# Altium schematic sheet FPGA Sheet1.SchDoc
size A2; Generated From FPGA Project: PortSwitcherFPGA1C.PrjFpg; UNUSED_SPECIAL: RouteSeparate; UNUSED_IO: NoERC; VREF: NoERC; UNUSED_INPUT: NoERC; DocumentNumber: 5; SheetNumber: 5; SheetTotal: 7
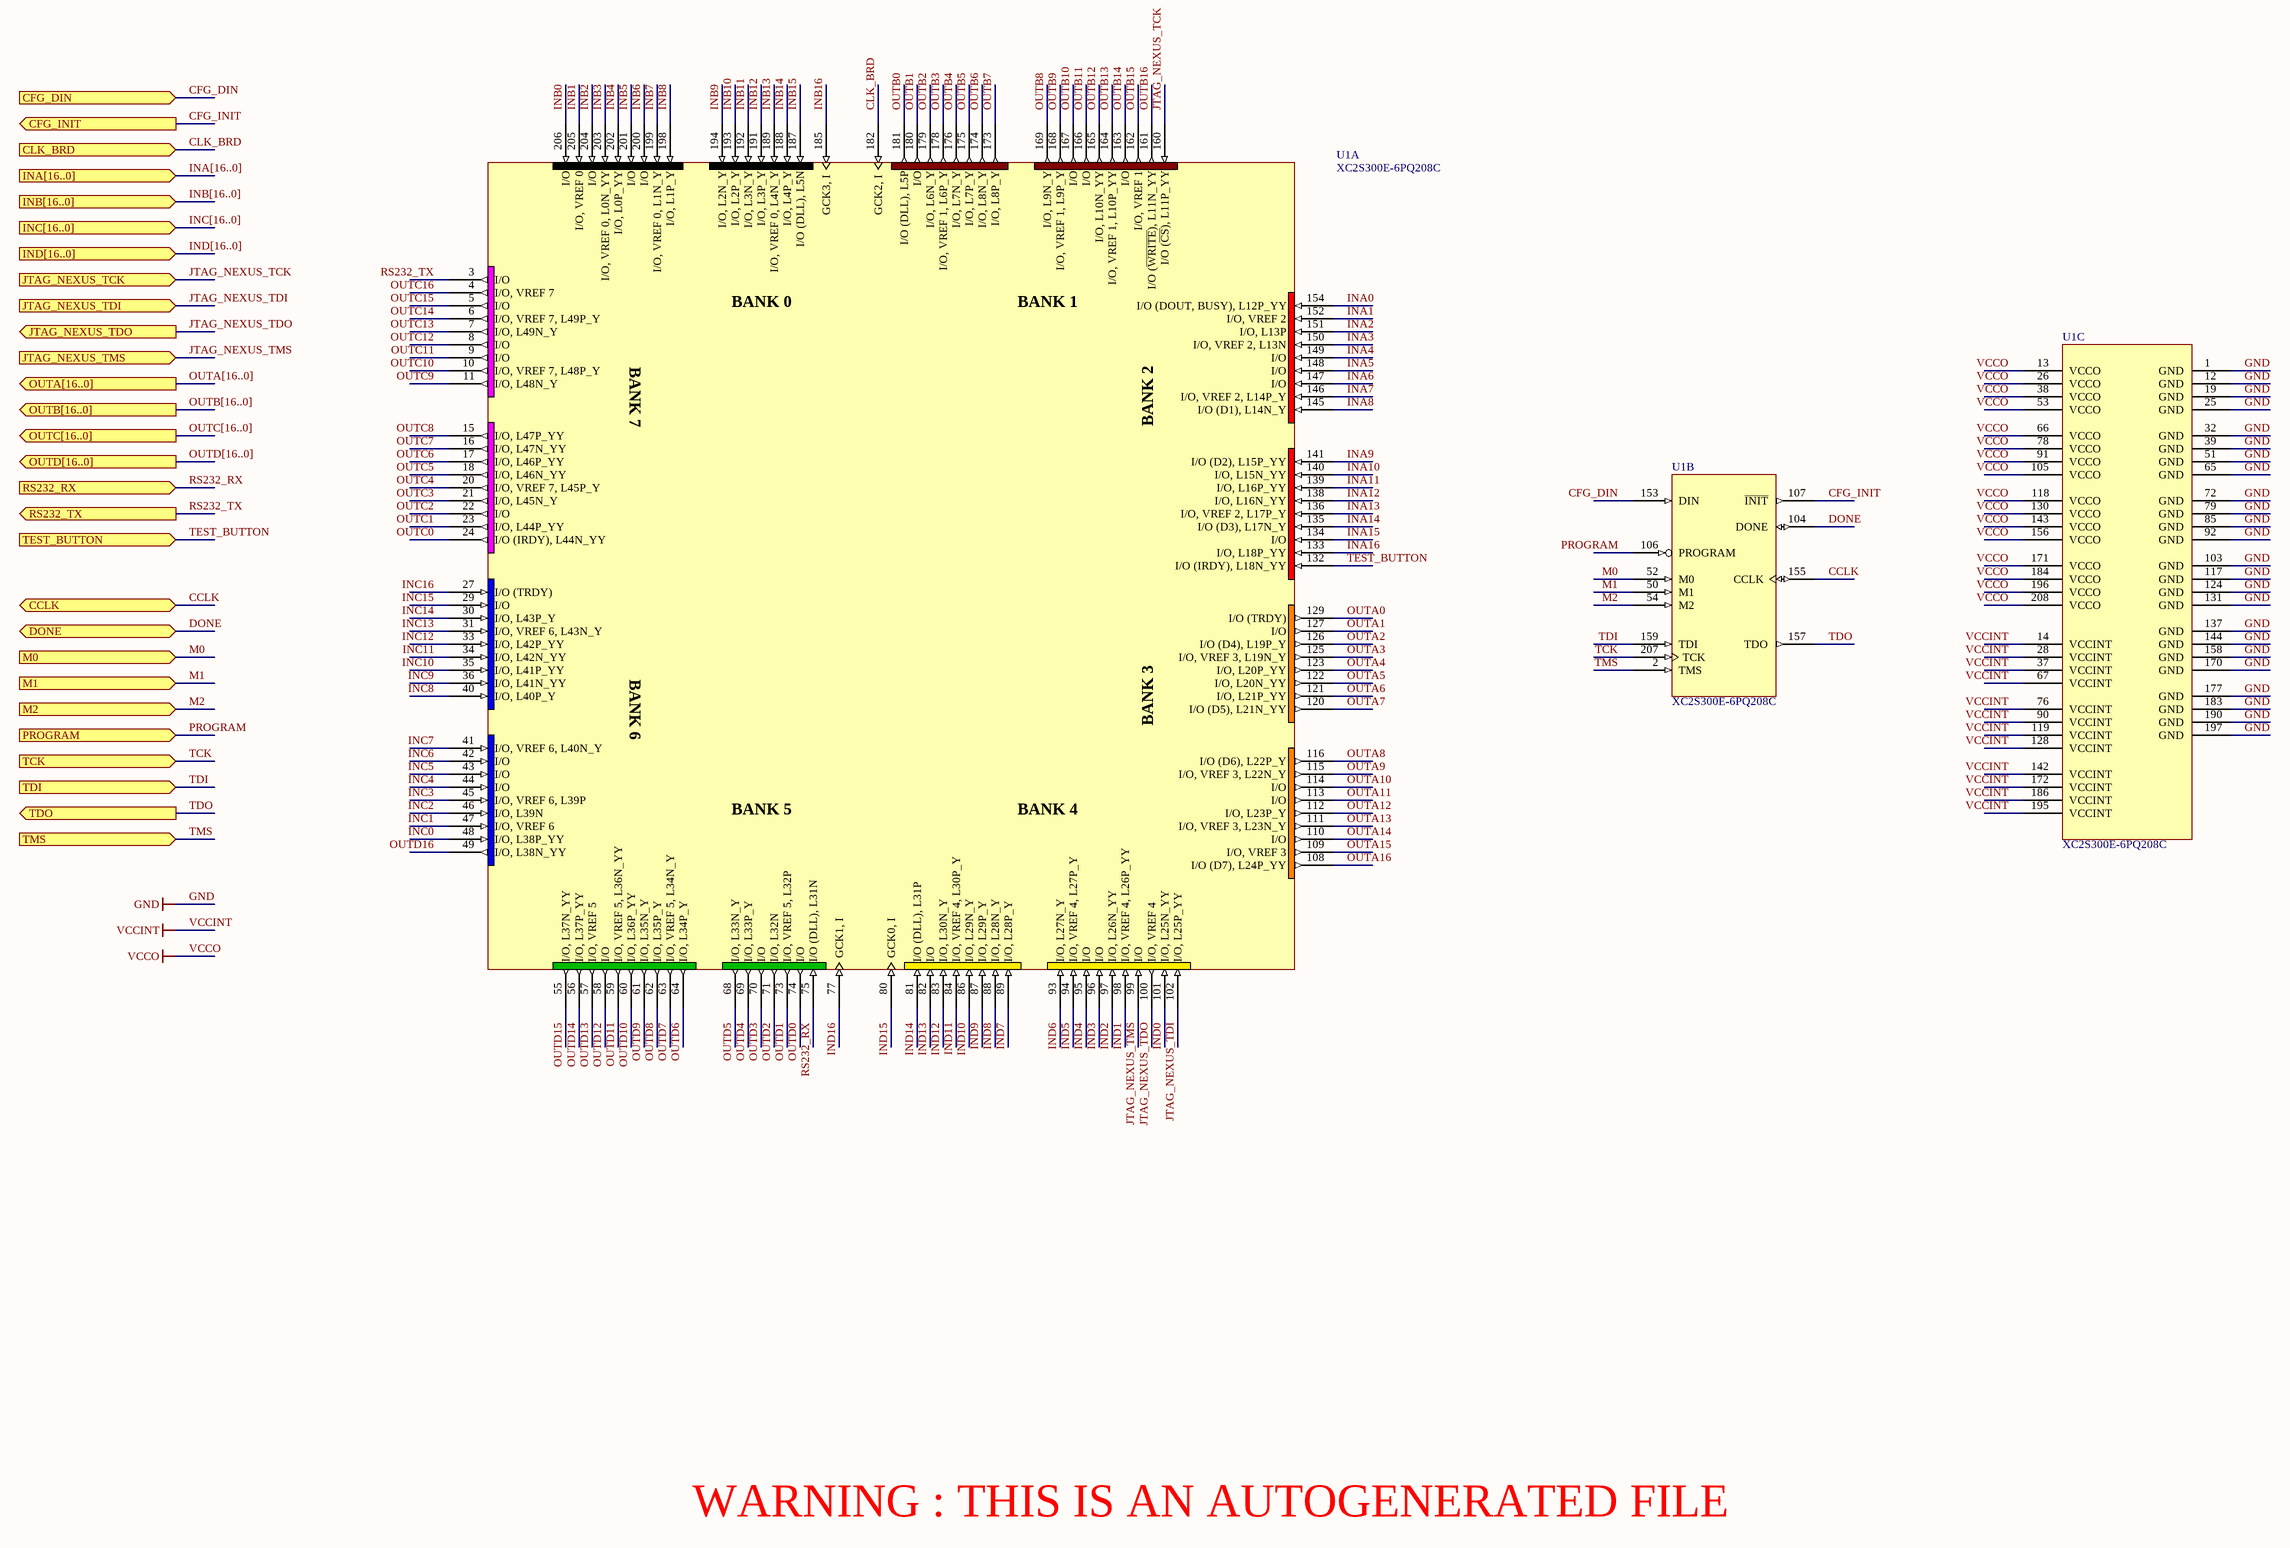
[diagram p0: FPGA Sheet1.SchDoc]

## Parts
U1  XC2S300E-6PQ208C  [PQ208]  (parts A,B,C of 3)

## Ports
CCLK (bidir), CFG_DIN (in), CFG_INIT (out), CLK_BRD (in), DONE (bidir), INA[16..0] (in), INB[16..0] (in), INC[16..0] (in), IND[16..0] (in), JTAG_NEXUS_TCK (in), JTAG_NEXUS_TDI (in), JTAG_NEXUS_TDO (out), JTAG_NEXUS_TMS (in), M0 (in), M1 (in), M2 (in), OUTA[16..0] (out), OUTB[16..0] (out), OUTC[16..0] (out), OUTD[16..0] (out), PROGRAM (in), RS232_RX (in), RS232_TX (out), TCK (in), TDI (in), TDO (out), TEST_BUTTON (in), TMS (in)

## Nets
GND: U1.1(GND) U1.12(GND) U1.19(GND) U1.25(GND) U1.32(GND) U1.39(GND) U1.51(GND) U1.65(GND) U1.72(GND) U1.79(GND) U1.85(GND) U1.92(GND) U1.103(GND) U1.117(GND) U1.124(GND) U1.131(GND) U1.137(GND) U1.144(GND) U1.158(GND) U1.170(GND) U1.177(GND) U1.183(GND) U1.190(GND) U1.197(GND)
VCCINT: U1.14(VCCINT) U1.28(VCCINT) U1.37(VCCINT) U1.67(VCCINT) U1.76(VCCINT) U1.90(VCCINT) U1.119(VCCINT) U1.128(VCCINT) U1.142(VCCINT) U1.172(VCCINT) U1.186(VCCINT) U1.195(VCCINT)
VCCO: U1.13(VCCO) U1.26(VCCO) U1.38(VCCO) U1.53(VCCO) U1.66(VCCO) U1.78(VCCO) U1.91(VCCO) U1.105(VCCO) U1.118(VCCO) U1.130(VCCO) U1.143(VCCO) U1.156(VCCO) U1.171(VCCO) U1.184(VCCO) U1.196(VCCO) U1.208(VCCO)
CCLK: U1.155(CCLK) ; port CCLK
CFG_DIN: U1.153(DIN) ; port CFG_DIN
CFG_INIT: U1.107(~{INIT}) ; port CFG_INIT
CLK_BRD: U1.182(GCK2,_I) ; port CLK_BRD
DONE: U1.104(DONE) ; port DONE
INA0: U1.154(I/O_(DOUT,_BUSY),_L12P_YY)
INA1: U1.152(I/O,_VREF_2)
INA2: U1.151(I/O,_L13P)
INA3: U1.150(I/O,_VREF_2,_L13N)
INA4: U1.149(I/O)
INA5: U1.148(I/O)
INA6: U1.147(I/O)
INA7: U1.146(I/O,_VREF_2,_L14P_Y)
INA8: U1.145(I/O_(D1),_L14N_Y)
INA9: U1.141(I/O_(D2),_L15P_YY)
INA10: U1.140(I/O,_L15N_YY)
INA11: U1.139(I/O,_L16P_YY)
INA12: U1.138(I/O,_L16N_YY)
INA13: U1.136(I/O,_VREF_2,_L17P_Y)
INA14: U1.135(I/O_(D3),_L17N_Y)
INA15: U1.134(I/O)
INA16: U1.133(I/O,_L18P_YY)
INB0: U1.206(I/O)
INB1: U1.205(I/O,_VREF_0)
INB2: U1.204(I/O)
INB3: U1.203(I/O,_VREF_0,_L0N_YY)
INB4: U1.202(I/O,_L0P_YY)
INB5: U1.201(I/O)
INB6: U1.200(I/O)
INB7: U1.199(I/O,_VREF_0,_L1N_Y)
INB8: U1.198(I/O,_L1P_Y)
INB9: U1.194(I/O,_L2N_Y)
INB10: U1.193(I/O,_L2P_Y)
INB11: U1.192(I/O,_L3N_Y)
INB12: U1.191(I/O,_L3P_Y)
INB13: U1.189(I/O,_VREF_0,_L4N_Y)
INB14: U1.188(I/O,_L4P_Y)
INB15: U1.187(I/O_(DLL),_L5N)
INB16: U1.185(GCK3,_I)
INC0: U1.48(I/O,_L38P_YY)
INC1: U1.47(I/O,_VREF_6)
INC2: U1.46(I/O,_L39N)
INC3: U1.45(I/O,_VREF_6,_L39P)
INC4: U1.44(I/O)
INC5: U1.43(I/O)
INC6: U1.42(I/O)
INC7: U1.41(I/O,_VREF_6,_L40N_Y)
INC8: U1.40(I/O,_L40P_Y)
INC9: U1.36(I/O,_L41N_YY)
INC10: U1.35(I/O,_L41P_YY)
INC11: U1.34(I/O,_L42N_YY)
INC12: U1.33(I/O,_L42P_YY)
INC13: U1.31(I/O,_VREF_6,_L43N_Y)
INC14: U1.30(I/O,_L43P_Y)
INC15: U1.29(I/O)
INC16: U1.27(I/O_(TRDY))
IND0: U1.101(I/O,_L25N_YY)
IND1: U1.98(I/O,_VREF_4,_L26P_YY)
IND2: U1.97(I/O,_L26N_YY)
IND3: U1.96(I/O)
IND4: U1.95(I/O)
IND5: U1.94(I/O,_VREF_4,_L27P_Y)
IND6: U1.93(I/O,_L27N_Y)
IND7: U1.89(I/O,_L28P_Y)
IND8: U1.88(I/O,_L28N_Y)
IND9: U1.87(I/O,_L29P_Y)
IND10: U1.86(I/O,_L29N_Y)
IND11: U1.84(I/O,_VREF_4,_L30P_Y)
IND12: U1.83(I/O,_L30N_Y)
IND13: U1.82(I/O)
IND14: U1.81(I/O_(DLL),_L31P)
IND15: U1.80(GCK0,_I)
IND16: U1.77(GCK1,_I)
JTAG_NEXUS_TCK: U1.160(I/O_(~{CS}),_L11P_YY) ; port JTAG_NEXUS_TCK
JTAG_NEXUS_TDI: U1.102(I/O,_L25P_YY) ; port JTAG_NEXUS_TDI
JTAG_NEXUS_TDO: U1.100(I/O,_VREF_4) ; port JTAG_NEXUS_TDO
JTAG_NEXUS_TMS: U1.99(I/O) ; port JTAG_NEXUS_TMS
M0: U1.52(M0) ; port M0
M1: U1.50(M1) ; port M1
M2: U1.54(M2) ; port M2
OUTA0: U1.129(I/O_(TRDY))
OUTA1: U1.127(I/O)
OUTA2: U1.126(I/O_(D4),_L19P_Y)
OUTA3: U1.125(I/O,_VREF_3,_L19N_Y)
OUTA4: U1.123(I/O,_L20P_YY)
OUTA5: U1.122(I/O,_L20N_YY)
OUTA6: U1.121(I/O,_L21P_YY)
OUTA7: U1.120(I/O_(D5),_L21N_YY)
OUTA8: U1.116(I/O_(D6),_L22P_Y)
OUTA9: U1.115(I/O,_VREF_3,_L22N_Y)
OUTA10: U1.114(I/O)
OUTA11: U1.113(I/O)
OUTA12: U1.112(I/O,_L23P_Y)
OUTA13: U1.111(I/O,_VREF_3,_L23N_Y)
OUTA14: U1.110(I/O)
OUTA15: U1.109(I/O,_VREF_3)
OUTA16: U1.108(I/O_(D7),_L24P_YY)
OUTB0: U1.181(I/O_(DLL),_L5P)
OUTB1: U1.180(I/O)
OUTB2: U1.179(I/O,_L6N_Y)
OUTB3: U1.178(I/O,_VREF_1,_L6P_Y)
OUTB4: U1.176(I/O,_L7N_Y)
OUTB5: U1.175(I/O,_L7P_Y)
OUTB6: U1.174(I/O,_L8N_Y)
OUTB7: U1.173(I/O,_L8P_Y)
OUTB8: U1.169(I/O,_L9N_Y)
OUTB9: U1.168(I/O,_VREF_1,_L9P_Y)
OUTB10: U1.167(I/O)
OUTB11: U1.166(I/O)
OUTB12: U1.165(I/O,_L10N_YY)
OUTB13: U1.164(I/O,_VREF_1,_L10P_YY)
OUTB14: U1.163(I/O)
OUTB15: U1.162(I/O,_VREF_1)
OUTB16: U1.161(I/O_(~{WRITE}),_L11N_YY)
OUTC0: U1.24(I/O_(IRDY),_L44N_YY)
OUTC1: U1.23(I/O,_L44P_YY)
OUTC2: U1.22(I/O)
OUTC3: U1.21(I/O,_L45N_Y)
OUTC4: U1.20(I/O,_VREF_7,_L45P_Y)
OUTC5: U1.18(I/O,_L46N_YY)
OUTC6: U1.17(I/O,_L46P_YY)
OUTC7: U1.16(I/O,_L47N_YY)
OUTC8: U1.15(I/O,_L47P_YY)
OUTC9: U1.11(I/O,_L48N_Y)
OUTC10: U1.10(I/O,_VREF_7,_L48P_Y)
OUTC11: U1.9(I/O)
OUTC12: U1.8(I/O)
OUTC13: U1.7(I/O,_L49N_Y)
OUTC14: U1.6(I/O,_VREF_7,_L49P_Y)
OUTC15: U1.5(I/O)
OUTC16: U1.4(I/O,_VREF_7)
OUTD0: U1.74(I/O)
OUTD1: U1.73(I/O,_VREF_5,_L32P)
OUTD2: U1.71(I/O,_L32N)
OUTD3: U1.70(I/O)
OUTD4: U1.69(I/O,_L33P_Y)
OUTD5: U1.68(I/O,_L33N_Y)
OUTD6: U1.64(I/O,_L34P_Y)
OUTD7: U1.63(I/O,_VREF_5,_L34N_Y)
OUTD8: U1.62(I/O,_L35P_Y)
OUTD9: U1.61(I/O,_L35N_Y)
OUTD10: U1.60(I/O,_L36P_YY)
OUTD11: U1.59(I/O,_VREF_5,_L36N_YY)
OUTD12: U1.58(I/O)
OUTD13: U1.57(I/O,_VREF_5)
OUTD14: U1.56(I/O,_L37P_YY)
OUTD15: U1.55(I/O,_L37N_YY)
OUTD16: U1.49(I/O,_L38N_YY)
PROGRAM: U1.106(PROGRAM) ; port PROGRAM
RS232_RX: U1.75(I/O_(DLL),_L31N) ; port RS232_RX
RS232_TX: U1.3(I/O) ; port RS232_TX
TCK: U1.207(TCK) ; port TCK
TDI: U1.159(TDI) ; port TDI
TDO: U1.157(TDO) ; port TDO
TEST_BUTTON: U1.132(I/O_(IRDY),_L18N_YY) ; port TEST_BUTTON
TMS: U1.2(TMS) ; port TMS

## Buses and harness runs
bus INA[16..0] = port INA[16..0]
bus INB[16..0] = port INB[16..0]
bus INC[16..0] = port INC[16..0]
bus IND[16..0] = port IND[16..0]
bus OUTA[16..0] = port OUTA[16..0]
bus OUTB[16..0] = port OUTB[16..0]
bus OUTC[16..0] = port OUTC[16..0]
bus OUTD[16..0] = port OUTD[16..0]

## Notes on the sheet
- WARNING : THIS IS AN AUTOGENERATED FILE
- (in symbol XC2S300E-6PQ208C, part A) BANK 0; BANK 1; BANK 7; BANK 2; BANK 6; BANK 3; BANK 5; BANK 4

## Library data of the parts
U1 = XC2S300E-6PQ208C: Spartan-IIE 1.8V FPGA, 208-Pin PQFP, Standard Performance, Commercial Grade; Package Information: Latest Revision: ver1.1, Oct-2002; Code - JEDEC: MS-029-FA-1; Published: 19-Jul-2002; Revision: 17-Sep-2003: Pin names updated to match datasheet, ver2.1.; Datasheet: Latest Revision: 09-Jul-2003; Package Reference: PQ208; Publisher: Altium Limited